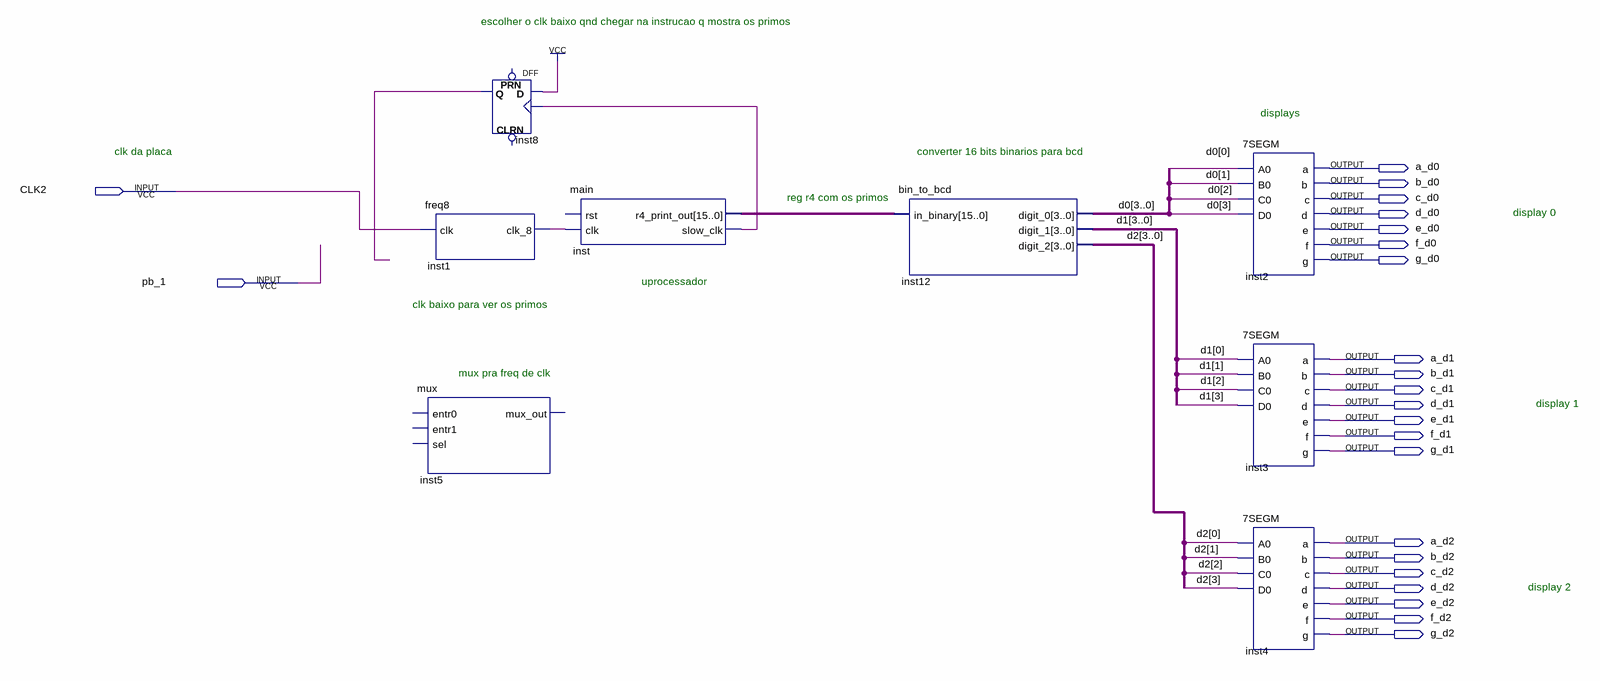
[diagram p0: schematic sheet]
// Quartus schematic up.bdf as structural Verilog: 8 symbols, 23 pins
module up (
  input  CLK2,
  input  pb_1,
  output a_d0,
  output b_d0,
  output c_d0,
  output d_d0,
  output e_d0,
  output f_d0,
  output g_d0,
  output a_d1,
  output b_d1,
  output c_d1,
  output d_d1,
  output e_d1,
  output f_d1,
  output g_d1,
  output a_d2,
  output b_d2,
  output c_d2,
  output d_d2,
  output e_d2,
  output f_d2,
  output g_d2
);

  wire inst1_clk_8, inst8_q, inst_slow_clk;
  wire [3:0] d0, d1, d2;
  wire [15:0] inst_r4_print_out;

  freq8 inst1 (.clk(CLK2), .clk_8(inst1_clk_8));
  mux inst5 ();  // open: entr0, entr1, sel, mux_out
  DFF inst8 (.CLK(inst_slow_clk), .D(1'b1), .Q(inst8_q));  // open: CLRN, PRN
  main inst (.clk(inst1_clk_8), .r4_print_out(inst_r4_print_out), .slow_clk(inst_slow_clk));  // open: rst
  bin_to_bcd inst12 (.in_binary(inst_r4_print_out), .digit_0(d0), .digit_1(d1), .digit_2(d2));
  \7SEGM  inst2 (
    .A0(d0[0]), .B0(d0[1]), .C0(d0[2]), .D0(d0[3]), .a(a_d0), .b(b_d0), .c(c_d0), .d(d_d0), .e(e_d0),
    .f(f_d0), .g(g_d0));
  \7SEGM  inst3 (
    .A0(d1[0]), .B0(d1[1]), .C0(d1[2]), .D0(d1[3]), .a(a_d1), .b(b_d1), .c(c_d1), .d(d_d1), .e(e_d1),
    .f(f_d1), .g(g_d1));
  \7SEGM  inst4 (
    .A0(d2[0]), .B0(d2[1]), .C0(d2[2]), .D0(d2[3]), .a(a_d2), .b(b_d2), .c(c_d2), .d(d_d2), .e(e_d2),
    .f(f_d2), .g(g_d2));

  // Notes on the sheet:
  //   escolher o clk baixo qnd chegar na instrucao q mostra os primos
  //   displays
  //   clk da placa
  //   converter 16 bits binarios para bcd
  //   reg r4 com os primos
  //   display 0
  //   uprocessador
  //   clk baixo para ver os primos
  //   mux pra freq de clk
  //   display 1
  //   display 2
endmodule
